# Altium schematic sheet Elvis_PCI.SchDoc
size A4; SheetNumber: 2; SheetTotal: 11
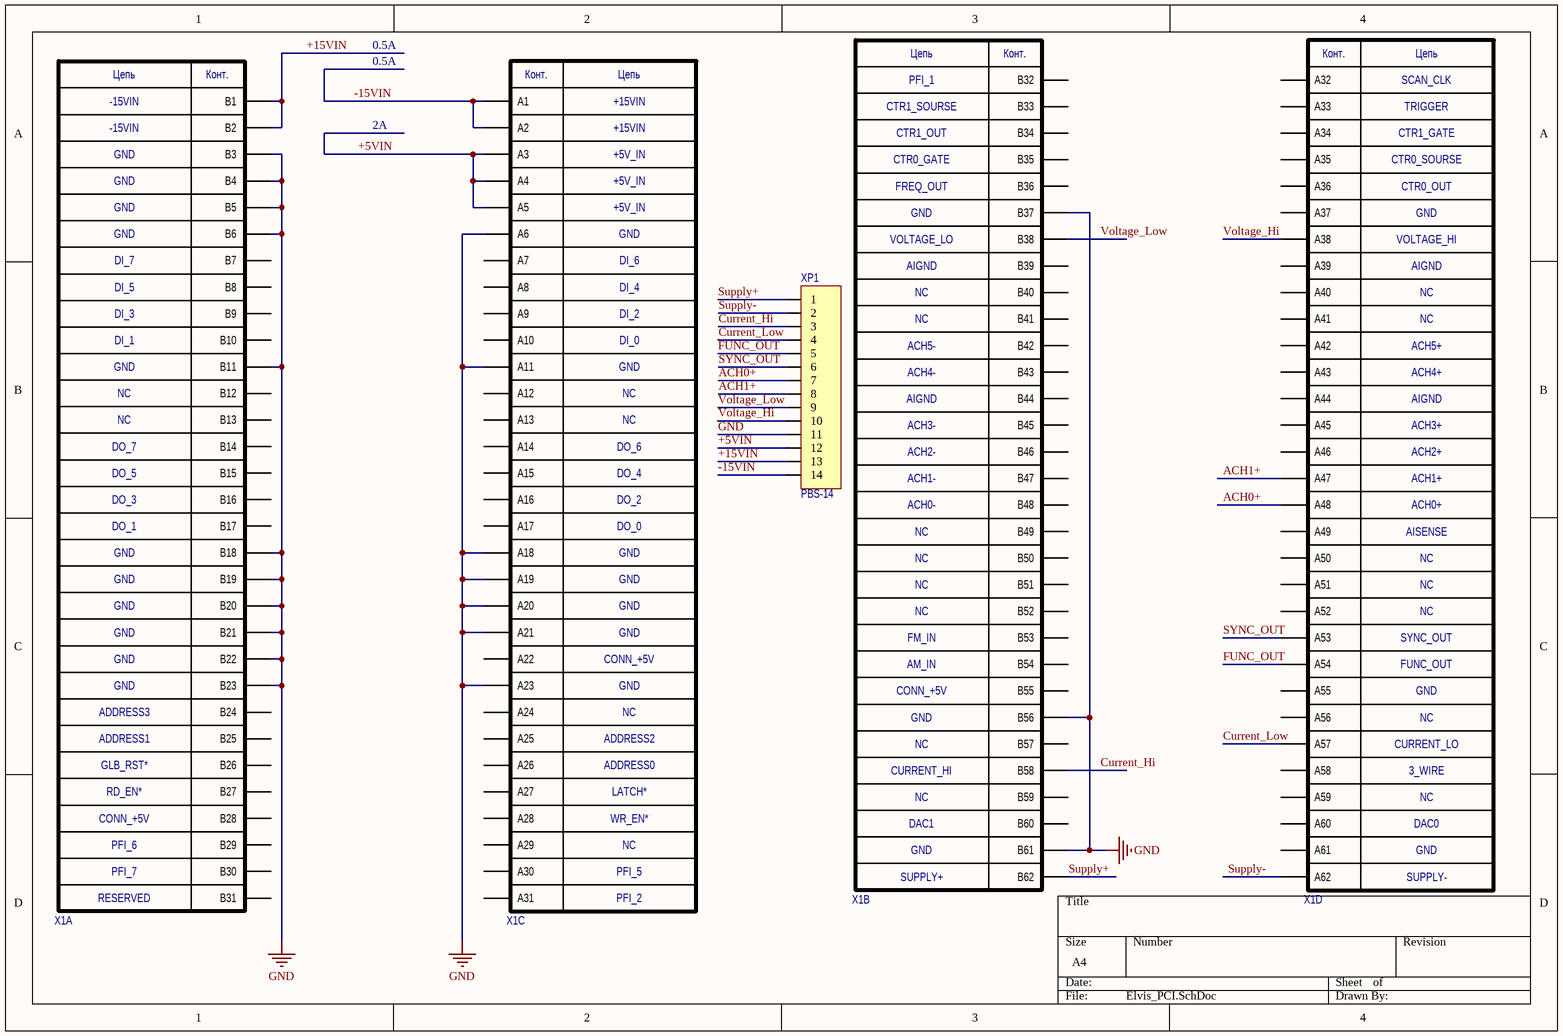
[diagram p0: Elvis_PCI.SchDoc]

## Parts
X1  PCI  [PCI]  (value not drawn)  (parts A,B,C,D of 4)
XP1  PBS-14  [PBS-14]

## Nets
GND: X1.A6 X1.A11 X1.A18 X1.A19 X1.A20 X1.A21 X1.A23 X1.B3 X1.B4 X1.B5 X1.B6 X1.B11 X1.B18 X1.B19 X1.B20 X1.B21 X1.B22 X1.B23 X1.B37 X1.B56 X1.B61 XP1.11
+5VIN: X1.A3 X1.A4 X1.A5 XP1.12
+15VIN: X1.B1 X1.B2 XP1.13
-15VIN: X1.A1 X1.A2 XP1.14
ACH0+: X1.A48 XP1.7
ACH1+: X1.A47 XP1.8
Current_Hi: X1.B58 XP1.3
Current_Low: X1.A57 XP1.4
FUNC_OUT: X1.A54 XP1.5
Supply+: X1.B62 XP1.1
Supply-: X1.A62 XP1.2
SYNC_OUT: X1.A53 XP1.6
Voltage_Hi: X1.A38 XP1.10
Voltage_Low: X1.B38 XP1.9

Not connected (* = marked no-connect by the designer): X1 A7 A8 A9 A10 A12 A13 A14 A15 A16 A17 A22 A24 A25 A26 A27 A28 A29 A30 A31 A32 A33 A34 A35 A36 A37 A39 A40 A41 A42 A43 A44 A45 A46 A49 A50 A51 A52 A55 A56 A58 A59 A60 A61 B7 B8 B9 B10 B12 B13 B14 B15 B16 B17 B24 B25 B26 B27 B28 B29 B30 B31 B32 B33 B34 B35 B36 B39 B40 B41 B42 B43 B44 B45 B46 B47 B48 B49 B50 B51 B52 B53 B54 B55 B57 B59 B60

## Notes on the sheet
- 0.5A
- 2A
- (in symbol PCI, part A) Цепь; Конт.; -15VIN; GND; DI_7; DI_5; DI_3; DI_1; NC; DO_7; DO_5; DO_3; DO_1; ADDRESS3; ADDRESS1; GLB_RST*; RD_EN*; CONN_+5V; PFI_6; PFI_7; RESERVED
- (in symbol PCI, part B) Цепь; Конт.; PFI_1; CTR1_SOURSE; CTR1_OUT; CTR0_GATE; FREQ_OUT; GND; VOLTAGE_LO; AIGND; NC; ACH5-; ACH4-; ACH3-; ACH2-; ACH1-; ACH0-; FM_IN; AM_IN; CONN_+5V; CURRENT_HI; DAC1; SUPPLY+
- (in symbol PCI, part C) Конт.; Цепь; +15VIN; +5V_IN; GND; DI_6; DI_4; DI_2; DI_0; NC; DO_6; DO_4; DO_2; DO_0; CONN_+5V; ADDRESS2; ADDRESS0; LATCH*; WR_EN*; PFI_5; PFI_2
- (in symbol PCI, part D) Конт.; Цепь; SCAN_CLK; TRIGGER; CTR1_GATE; CTR0_SOURSE; CTR0_OUT; GND; VOLTAGE_HI; AIGND; NC; ACH5+; ACH4+; ACH3+; ACH2+; ACH1+; ACH0+; AISENSE; SYNC_OUT; FUNC_OUT; CURRENT_LO; 3_WIRE; DAC0; SUPPLY-